# EAGLE design mother_v1 (EAGLE 9.6.2)
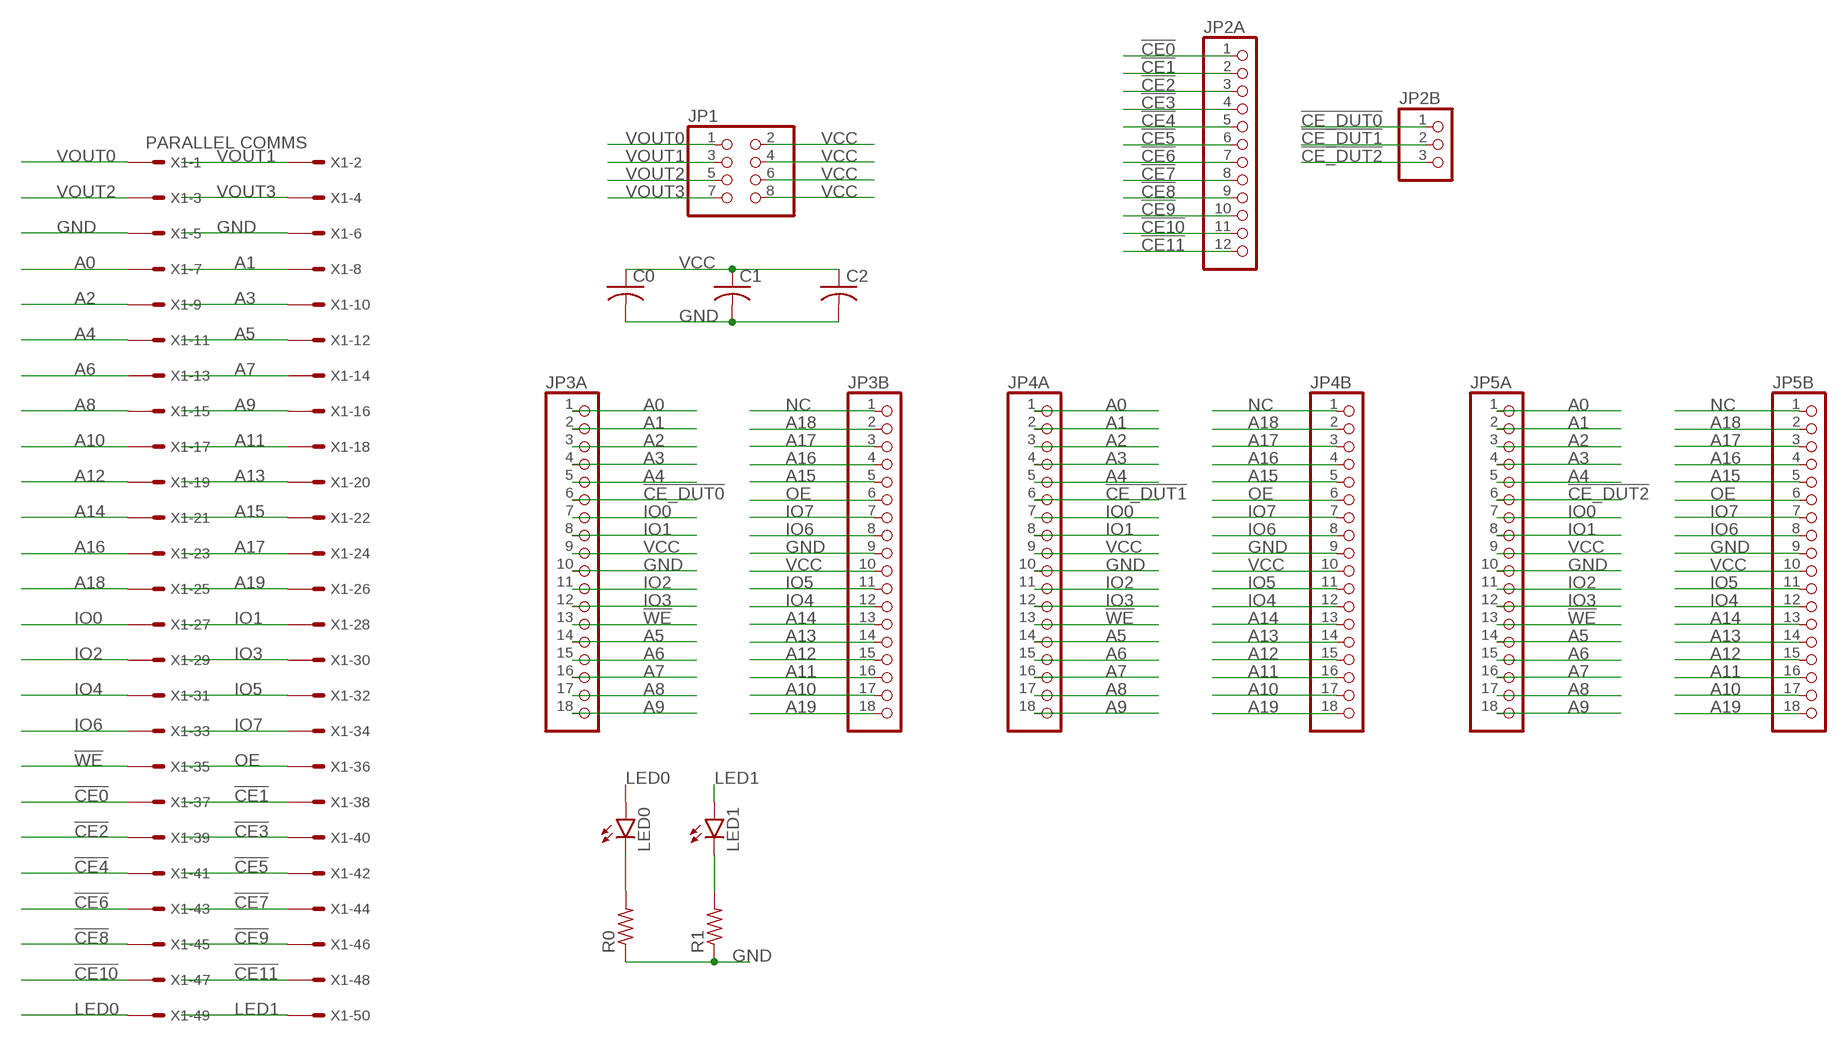
[diagram p0: schematic, sheet 1]

## Parts
C0  C-USC0805  [C0805]
C1  C-USC0805  [C0805]
C2  C-USC0805  [C0805]
JP1  PINHD-2X4  [2X04]
JP2A  PINHD-1X12  [1X12]
JP2B  PINHD-1X3  [1X03]
JP3A  PINHD-1X18  [1X18]
JP3B  PINHD-1X18  [1X18]
JP4A  PINHD-1X18  [1X18]
JP4B  PINHD-1X18  [1X18]
JP5A  PINHD-1X18  [1X18]
JP5B  PINHD-1X18  [1X18]
LED0  LED3MM  [LED3MM]
LED1  LED3MM  [LED3MM]
R0  R-US_0204/7  [0204/7]
R1  R-US_0204/7  [0204/7]
X1  PARALLEL COMMS  057-050-1  [057-050-1]

## Nets
!CE0: JP2A.1 X1.37
!CE1: JP2A.2 X1.38
!CE2: JP2A.3 X1.39
!CE3: JP2A.4 X1.40
!CE4: JP2A.5 X1.41
!CE5: JP2A.6 X1.42
!CE6: JP2A.7 X1.43
!CE7: JP2A.8 X1.44
!CE8: JP2A.9 X1.45
!CE9: JP2A.10 X1.46
!CE10: JP2A.11 X1.47
!CE11: JP2A.12 X1.48
!CE_DUT0: JP2B.1 JP3A.6
!CE_DUT1: JP2B.2 JP4A.6
!CE_DUT2: JP2B.3 JP5A.6
!WE: JP3A.13 JP4A.13 JP5A.13 X1.35
A0: JP3A.1 JP4A.1 JP5A.1 X1.7
A1: JP3A.2 JP4A.2 JP5A.2 X1.8
A2: JP3A.3 JP4A.3 JP5A.3 X1.9
A3: JP3A.4 JP4A.4 JP5A.4 X1.10
A4: JP3A.5 JP4A.5 JP5A.5 X1.11
A5: JP3A.14 JP4A.14 JP5A.14 X1.12
A6: JP3A.15 JP4A.15 JP5A.15 X1.13
A7: JP3A.16 JP4A.16 JP5A.16 X1.14
A8: JP3A.17 JP4A.17 JP5A.17 X1.15
A9: JP3A.18 JP4A.18 JP5A.18 X1.16
A10: JP3B.17 JP4B.17 JP5B.17 X1.17
A11: JP3B.16 JP4B.16 JP5B.16 X1.18
A12: JP3B.15 JP4B.15 JP5B.15 X1.19
A13: JP3B.14 JP4B.14 JP5B.14 X1.20
A14: JP3B.13 JP4B.13 JP5B.13 X1.21
A15: JP3B.5 JP4B.5 JP5B.5 X1.22
A16: JP3B.4 JP4B.4 JP5B.4 X1.23
A17: JP3B.3 JP4B.3 JP5B.3 X1.24
A18: JP3B.2 JP4B.2 JP5B.2 X1.25
A19: JP3B.18 JP4B.18 JP5B.18 X1.26
GND: C0.2 C1.2 C2.2 JP3A.10 JP3B.9 JP4A.10 JP4B.9 JP5A.10 JP5B.9 R0.1 R1.1 X1.5 X1.6
IO0: JP3A.7 JP4A.7 JP5A.7 X1.27
IO1: JP3A.8 JP4A.8 JP5A.8 X1.28
IO2: JP3A.11 JP4A.11 JP5A.11 X1.29
IO3: JP3A.12 JP4A.12 JP5A.12 X1.30
IO4: JP3B.12 JP4B.12 JP5B.12 X1.31
IO5: JP3B.11 JP4B.11 JP5B.11 X1.32
IO6: JP3B.8 JP4B.8 JP5B.8 X1.33
IO7: JP3B.7 JP4B.7 JP5B.7 X1.34
LED0: LED0.A X1.49
LED1: LED1.A X1.50
N$1: LED0.K(C) R0.2
N$2: LED1.K(C) R1.2
NC: JP3B.1 JP4B.1 JP5B.1
OE: JP3B.6 JP4B.6 JP5B.6 X1.36
VCC: C0.1 C1.1 C2.1 JP1.2 JP1.4 JP1.6 JP1.8 JP3A.9 JP3B.10 JP4A.9 JP4B.10 JP5A.9 JP5B.10
VOUT0: JP1.1 X1.1
VOUT1: JP1.3 X1.2
VOUT2: JP1.5 X1.3
VOUT3: JP1.7 X1.4

## Library data of the parts
C0 C1 C2 = rcl:C-US: CAPACITOR, American symbol; SPICEPREFIX: C
JP1 = pinhead:PINHD-2X4: PIN HEADER
JP2A = pinhead:PINHD-1X12: PIN HEADER
JP2B = pinhead:PINHD-1X3: PIN HEADER
JP3A JP3B JP4A JP4B JP5A JP5B = pinhead:PINHD-1X18: PIN HEADER
LED0 LED1 = led:LED: LED OSRAM: - CHIPLED LG R971, LG N971, LY N971, LG Q971, LY Q971, LO R971, LY R971 LH N974, LH R974 LS Q976, LO Q976, LY Q976 LO Q996 - Hyper CHIPLED LW Q18S LB Q993, LB Q99A, LB R99A - SideLED LS A670, LO A670, LY A670, LG A670, LP A670 LB A673, LV A673, LT A673, LW A673 LH A674 LY A675 LS A676, LA A676, LO A676, LY A676, LW A676 LS A679, LY A679, LG A679 - Hyper Micro SIDELED® LS Y876, LA Y876, LO Y876, LY Y876 LT Y87S - SmartLED LW L88C, LW L88S LB L89C, LB L89S, LG L890 LS L89K, LO L89K, LY L89K LS L896, LA L896, LO L896, LY L896 - TOPLED LS T670, LO T670, LY T670, LG T670, LP T670 LSG T670, LSP T670, LSY T670, LOP T670, LYG T670 LG T671, LOG T671, LSG T671 LB T673, LV T673, LT T673, LW T673 LH T674 LS T676, LA T676, LO T676, LY T676, LB T676, LH T676, LSB T676, LW T676 LB T67C, LV T67C, LT T67C, LS T67K, LO T67K, LY T67K, LW E67C LS E67B, LA E67B, LO E67B, LY E67B, LB E67C, LV E67C, LT E67C LW T67C LS T679, LY T679, LG T679 LS T770, LO T770, LY T770, LG T770, LP T770 LB T773, LV T773, LT T773, LW T773 LH T774 LS E675, LA E675, LY E675, LS T675 LS T776, LA T776, LO T776, LY T776, LB T776 LHGB T686 LT T68C, LB T68C - Hyper Mini TOPLED® LB M676 - Mini TOPLED Santana® LG M470 LS M47K, LO M47K, LY M47K Source: http://www.osram.convergy.de LUXEON: - LUMILED® LXK2-PW12-R00, LXK2-PW12-S00, LXK2-PW14-U00, LXK2-PW14-V00 LXK2-PM12-R00, LXK2-PM12-S00, LXK2-PM14-U00 LXK2-PE12-Q00, LXK2-PE12-R00, LXK2-PE12-S00, LXK2-PE14-T00, LXK2-PE14-U00 LXK2-PB12-K00, LXK2-PB12-L00, LXK2-PB12-M00, LXK2-PB14-N00, LXK2-PB14-P00, LXK2-PB14-Q00 LXK2-PR12-L00, LXK2-PR12-M00, LXK2-PR14-Q00, LXK2-PR14-R00 LXK2-PD12-Q00, LXK2-PD12-R00, LXK2-PD12-S00 LXK2-PH12-R00, LXK2-PH12-S00 LXK2-PL12-P00, LXK2-PL12-Q00, LXK2-PL12-R00 Source: www.luxeon.com KINGBRIGHT: KA-3528ASYC Source: www.kingbright.com
R0 R1 = rcl:R-US_: RESISTOR, American symbol; SPICEPREFIX: R
X1 = con-panduit:057-050-: CONNECTOR 50-pin series 057 contact pc board low profile headers; OC_FARNELL: unknown; OC_NEWARK: unknown

## Net classes
2 lowpower: width 0.305 mm, drill 0.483 mm

## Board
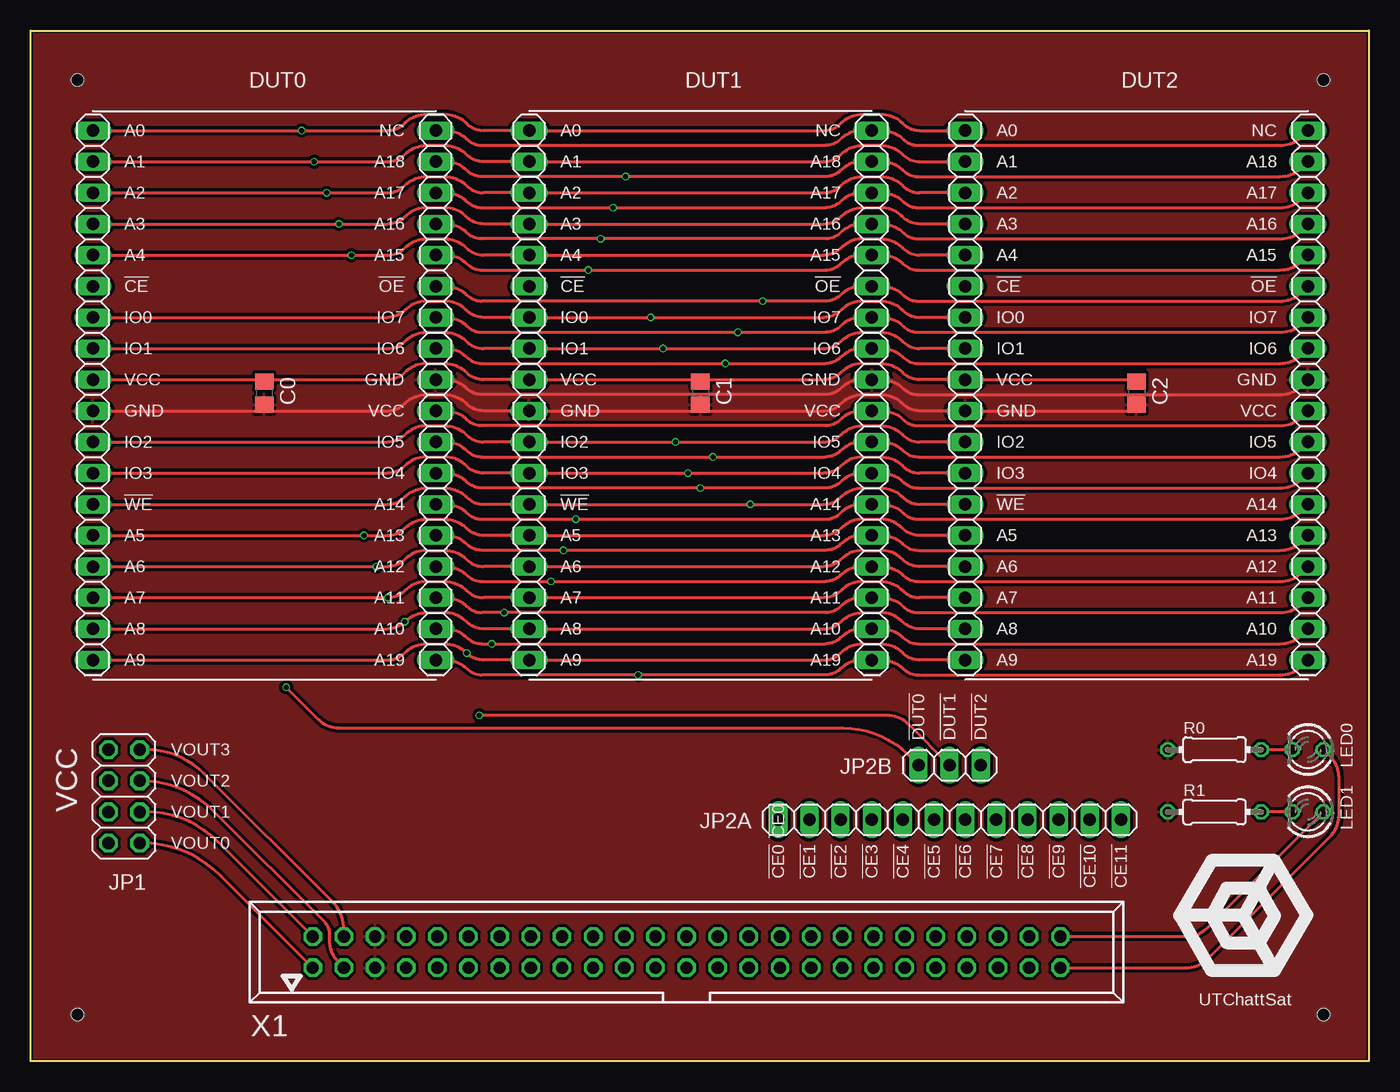
[diagram p1: board, top side]
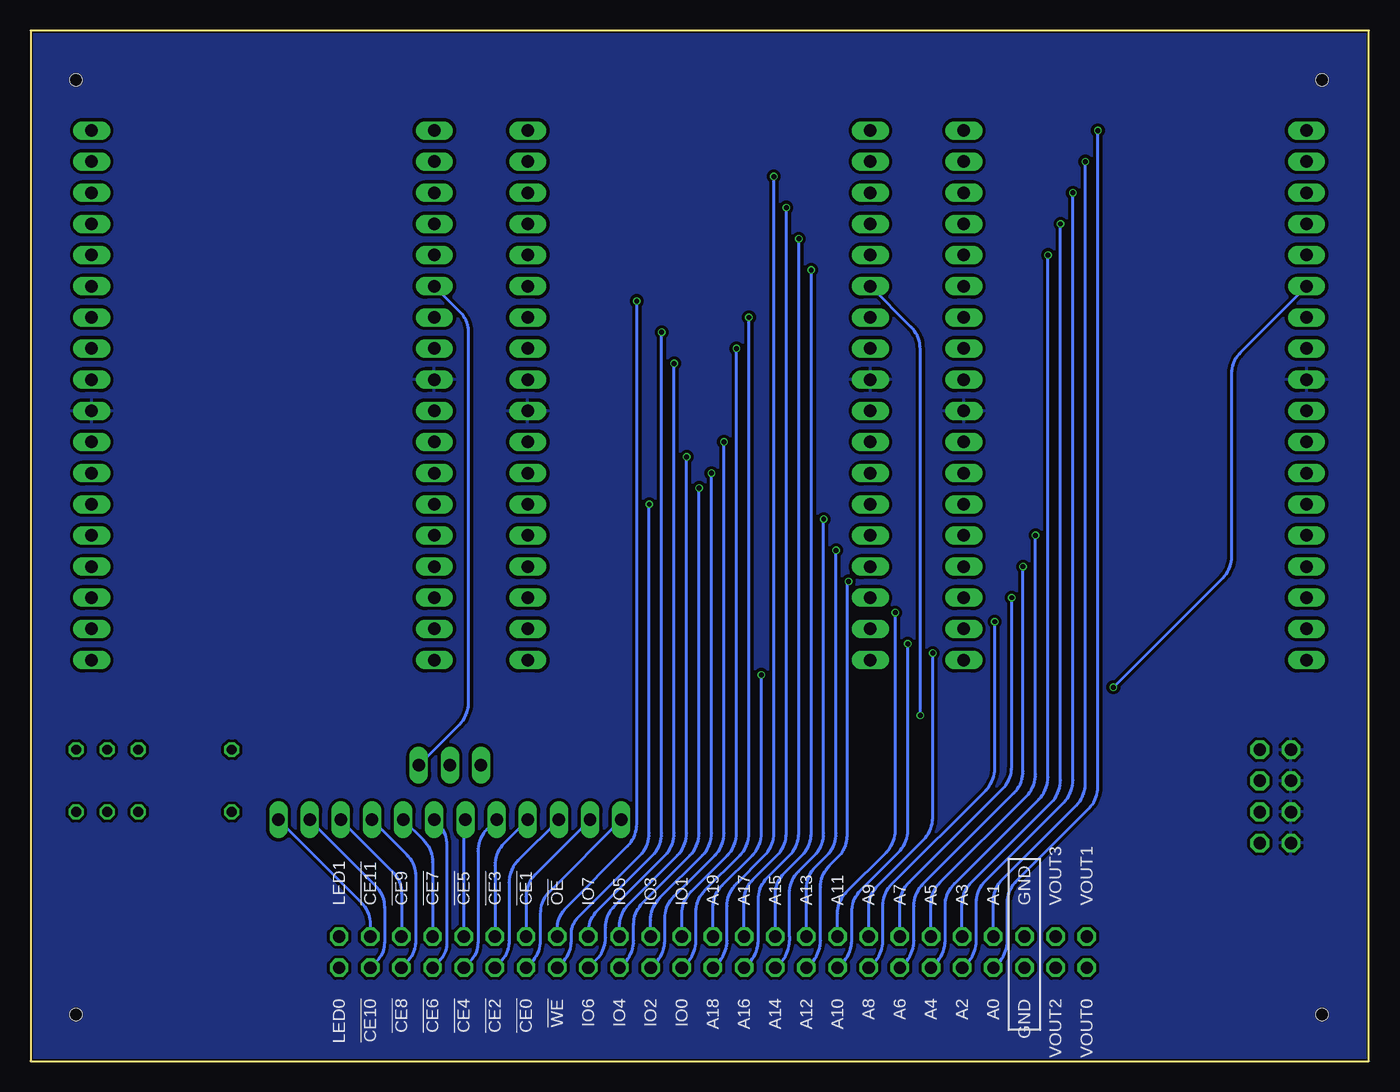
[diagram p2: board, bottom side, seen from below]

Size 109.11 x 84.03 mm. Coordinates in mm from the lower left corner, seen from the top.
Outline: 0,0 0,84.03 109.11,84.03 109.11,0 0,0
Copper layers (1*16): Top 0.035mm / dielectric 0.2mm / Bottom 0.035mm
Design rules "jlcpcb-2-layer *": minimum track width 10mil, minimum drill 0.2mm, track to track 10mil, track to pad 10mil, pad to pad 5mil, via to via 5mil, smd to smd 0mil, copper to edge 0.1mm, drill to drill 5mil, minimum pad ring 4mil, minimum via ring 4mil, stop-mask expansion 3mil, vias tented up to drill 100mil, thermal gap 10mil
Holes 1 mm at 3.81,3.81 3.81,80.01 105.41,80.01 105.41,3.81

### Footprints (pad centres in the part's own frame; a part is rotated, then mirrored left to right if it is on the bottom)
C0805 = smd 1.3 x 1.5: 1 -0.95,0; 2 0.95,0
2X04 = drill 1.016 octagon: 1 -3.81,-1.27; 2 -3.81,1.27; 3 -1.27,-1.27; 4 -1.27,1.27; 5 1.27,-1.27; 6 1.27,1.27; 7 3.81,-1.27; 8 3.81,1.27
1X12 = drill 1.016 long: 1 -13.97,0; 2 -11.43,0; 3 -8.89,0; 4 -6.35,0; 5 -3.81,0; 6 -1.27,0; 7 1.27,0; 8 3.81,0; 9 6.35,0; 10 8.89,0; 11 11.43,0; 12 13.97,0
1X03 = drill 1.016 long: 1 -2.54,0; 2 0,0; 3 2.54,0
1X18 = drill 1.016 long: 1 -21.59,0; 2 -19.05,0; 3 -16.51,0; 4 -13.97,0; 5 -11.43,0; 6 -8.89,0; 7 -6.35,0; 8 -3.81,0; 9 -1.27,0; 10 1.27,0; 11 3.81,0; 12 6.35,0; 13 8.89,0; 14 11.43,0; 15 13.97,0; 16 16.51,0; 17 19.05,0; 18 21.59,0
LED3MM = drill 0.813 octagon: A -1.27,0; K 1.27,0
0204/7 = drill 0.813 octagon: 1 -3.81,0; 2 3.81,0
057-050-1 = drill 1 octagon: 1 -30.48,-1.27; 2 -30.48,1.27; 3 -27.94,-1.27; 4 -27.94,1.27; 5 -25.4,-1.27; 6 -25.4,1.27; 7 -22.86,-1.27; 8 -22.86,1.27; 9 -20.32,-1.27; 10 -20.32,1.27; 11 -17.78,-1.27; 12 -17.78,1.27; 13 -15.24,-1.27; 14 -15.24,1.27; 15 -12.7,-1.27; 16 -12.7,1.27; 17 -10.16,-1.27; 18 -10.16,1.27; 19 -7.62,-1.27; 20 -7.62,1.27; 21 -5.08,-1.27; 22 -5.08,1.27; 23 -2.54,-1.27; 24 -2.54,1.27; 25 0,-1.27; 26 0,1.27; 27 2.54,-1.27; 28 2.54,1.27; 29 5.08,-1.27; 30 5.08,1.27; 31 7.62,-1.27; 32 7.62,1.27; 33 10.16,-1.27; 34 10.16,1.27; 35 12.7,-1.27; 36 12.7,1.27; 37 15.24,-1.27; 38 15.24,1.27; 39 17.78,-1.27; 40 17.78,1.27; 41 20.32,-1.27; 42 20.32,1.27; 43 22.86,-1.27; 44 22.86,1.27; 45 25.4,-1.27; 46 25.4,1.27; 47 27.94,-1.27; 48 27.94,1.27; 49 30.48,-1.27; 50 30.48,1.27

### Placement (x,y rotation side)
C0  19.05,54.48 270 top
C1  54.61,54.48 270 top
C2  90.17,54.48 270 top
JP1  7.62,21.59 90 top
JP2A  74.93,19.68 0 top
JP2B  74.93,24.13 0 top
JP3A  5.08,54.3 270 top
JP3B  33.02,54.3 270 top
JP4A  40.64,54.3 270 top
JP4B  68.58,54.3 270 top
JP5A  76.2,54.3 270 top
JP5B  104.14,54.3 270 top
LED0  104.14,25.4 180 top
LED1  104.14,20.32 180 top
R0  96.52,25.4 0 top
R1  96.52,20.32 0 top
X1  53.48,8.89 0 top

### Tracks (layer width: path | path; a pad name or v marks a point on that pad's centre or on a via)
!CE0
  Bottom 0.254: JP2A.1 66.82,13.82 arc-45 67.56,12.03 67.56,9.83 arc45 68.31,8.03 X1.37
!CE1
  Bottom 0.254: JP2A.2 67.98,15.21 arc-45 68.72,13.41 X1.38
!CE2
  Bottom 0.254: JP2A.3 69.36,16.36 arc-45 70.1,14.57 70.1,9.83 arc45 70.85,8.03 X1.39
!CE3
  Bottom 0.254: JP2A.4 70.52,17.75 arc-45 71.26,15.95 X1.40
!CE4
  Bottom 0.254: JP2A.5 71.9,18.91 arc-45 72.64,17.11 72.64,9.65 arc45 73.26,8.16 X1.41
!CE5
  Bottom 0.254: JP2A.6 arc-45 73.8,19.35 X1.42
!CE6
  Bottom 0.254: JP2A.7 75.93,19.41 arc45 75.18,17.62 75.18,9.65 arc45 75.8,8.16 X1.43
!CE7
  Bottom 0.254: JP2A.8 77.08,18.03 arc45 76.34,16.23 X1.44
!CE8
  Bottom 0.254: JP2A.9 78.47,16.87 arc45 77.72,15.08 77.72,9.83 arc45 78.47,8.03 X1.45
!CE9
  Bottom 0.254: JP2A.10 79.62,15.49 arc45 78.88,13.69 X1.46
!CE10
  Bottom 0.254: JP2A.11 81.01,14.33 arc45 80.26,12.54 80.26,9.65 arc45 80.88,8.16 X1.47
!CE11
  Bottom 0.254: JP2A.12 82.16,12.95 arc45 81.42,11.15 X1.48
!CE_DUT0  (via drill 0.4)
  Top 0.254: JP2B.1 71.55,24.97 arc45 66.21,27.18 25.18,27.18 arc-45 23.39,27.92 v20.83,30.48
  Bottom 0.254: v20.83,30.48 11.92,39.39 arc-45 11.18,41.18 11.18,56.04 arc45 10.43,57.84 JP3A.6
!CE_DUT1  (via drill 0.4)
  Top 0.254: JP2B.2 71.61,27.45 arc45 69.81,28.19 v36.58,28.19
  Bottom 0.254: v36.58,28.19 36.58,58.07 arc-45 37.32,59.87 JP4A.6
!CE_DUT2
  Bottom 0.254: JP2B.3 74.15,27.45 arc-45 73.41,29.25 73.41,59.44 arc-45 74.08,61.08 JP5A.6
!WE  (via drill 0.4)
  Top 0.254: JP3A.13 29.12,45.41 arc45 30.48,45.97 30.5,45.99 arc-45 32.29,46.74 33.75,46.74 arc-45 35.54,45.99 35.56,45.97 arc45 36.92,45.41 JP4A.13 v58.67,45.41 64.68,45.41 arc45 66.04,45.97 66.06,45.99 arc-45 67.85,46.74 69.31,46.74 arc-45 71.1,45.99 71.12,45.97 arc45 72.48,45.41 JP5A.13
  Bottom 0.254: X1.35 65.77,8.03 arc-45 65.02,9.83 65.02,10.41 arc45 64.48,11.71 59.42,16.78 arc-45 58.67,18.58 v58.67,45.41
A0  (via drill 0.4)
  Top 0.254: JP3A.1 v22.1,75.89 29.12,75.89 arc45 30.48,76.45 30.5,76.47 arc-45 32.29,77.22 33.75,77.22 arc-45 35.54,76.47 35.56,76.45 arc45 36.92,75.89 JP4A.1 64.68,75.89 arc45 66.04,76.45 66.04,76.47 66.06,76.47 arc-45 67.85,77.22 69.31,77.22 arc-45 71.1,76.47 71.12,76.47 71.12,76.45 arc45 72.48,75.89 JP5A.1
  Bottom 0.254: X1.7 30.21,8.03 arc-45 29.46,9.83 29.46,12.92 arc45 28.72,14.71 22.84,20.59 arc-45 22.1,22.39 v22.1,75.89
A1  (via drill 0.4)
  Top 0.254: JP3A.2 v23.11,73.35 29.12,73.35 arc45 30.48,73.91 30.5,73.93 arc-45 32.29,74.68 33.75,74.68 arc-45 35.54,73.93 35.56,73.91 arc45 36.92,73.35 JP4A.2 64.68,73.35 arc45 66.04,73.91 66.06,73.93 arc-45 67.85,74.68 69.31,74.68 arc-45 71.1,73.93 71.12,73.91 arc45 72.48,73.35 JP5A.2
  Bottom 0.254: X1.8 30.62,13.03 arc45 29.88,14.83 23.86,20.85 arc-45 23.11,22.64 v23.11,73.35
A2  (via drill 0.4)
  Top 0.254: JP3A.3 v24.13,70.81 29.12,70.81 arc45 30.48,71.37 30.5,71.39 arc-45 32.29,72.14 33.75,72.14 arc-45 35.54,71.39 35.56,71.37 arc45 36.92,70.81 JP4A.3 64.68,70.81 arc45 66.04,71.37 66.04,71.39 66.06,71.39 arc-45 67.85,72.14 69.31,72.14 arc-45 71.1,71.39 71.12,71.39 71.12,71.37 arc45 72.48,70.81 JP5A.3
  Bottom 0.254: X1.9 32.75,8.03 arc-45 32,9.83 32,12.92 arc45 31.26,14.71 24.87,21.1 arc-45 24.13,22.9 v24.13,70.81
A3  (via drill 0.4)
  Top 0.254: JP3A.4 v25.15,68.27 29.12,68.27 arc45 30.48,68.83 30.5,68.85 arc-45 32.29,69.6 33.75,69.6 arc-45 35.54,68.85 35.56,68.83 arc45 36.92,68.27 JP4A.4 64.68,68.27 arc45 66.04,68.83 66.04,68.85 66.06,68.85 arc-45 67.85,69.6 69.31,69.6 arc-45 71.1,68.85 71.1,68.83 71.12,68.83 arc45 72.48,68.27 JP5A.4
  Bottom 0.254: X1.10 33.16,12.78 arc45 32.42,14.57 25.89,21.1 arc-45 25.15,22.9 v25.15,68.27
A4  (via drill 0.4)
  Top 0.254: JP3A.5 v26.16,65.73 29.12,65.73 arc45 30.48,66.29 30.5,66.31 arc-45 32.29,67.06 33.75,67.06 arc-45 35.54,66.31 35.56,66.29 arc45 36.92,65.73 JP4A.5 64.68,65.73 arc45 66.04,66.29 66.06,66.29 66.06,66.31 arc-45 67.85,67.06 69.31,67.06 arc-45 71.1,66.31 71.12,66.31 71.12,66.29 arc45 72.48,65.73 JP5A.5
  Bottom 0.254: X1.11 35.29,8.03 arc-45 34.54,9.83 34.54,12.66 arc45 33.8,14.46 26.91,21.35 arc-45 26.16,23.15 v26.16,65.73
A5  (via drill 0.4)
  Top 0.254: JP3A.14 v27.18,42.87 29.12,42.87 arc45 30.48,43.43 30.5,43.45 arc-45 32.29,44.2 33.75,44.2 arc-45 35.54,43.45 35.56,43.43 arc45 36.92,42.87 JP4A.14 64.68,42.87 arc45 66.04,43.43 66.06,43.45 arc-45 67.85,44.2 69.31,44.2 arc-45 71.1,43.45 71.12,43.43 arc45 72.48,42.87 JP5A.14
  Bottom 0.254: X1.12 35.7,12.78 arc45 34.96,14.57 27.92,21.61 arc-45 27.18,23.4 v27.18,42.87
A6  (via drill 0.4)
  Top 0.254: JP3A.15 v28.19,40.33 29.12,40.33 arc45 30.48,40.89 30.5,40.91 arc-45 32.29,41.66 33.75,41.66 arc-45 35.54,40.91 35.56,40.89 arc45 36.92,40.33 JP4A.15 64.68,40.33 arc45 66.04,40.89 66.06,40.91 arc-45 67.85,41.66 69.31,41.66 arc-45 71.1,40.91 71.12,40.89 arc45 72.48,40.33 JP5A.15
  Bottom 0.254: X1.13 37.83,8.03 arc-45 37.08,9.83 37.08,12.66 arc45 36.34,14.46 28.94,21.86 arc-45 28.19,23.66 v28.19,40.33
A7  (via drill 0.4)
  Top 0.254: JP3A.16 v29.12,37.79 arc45 30.48,38.35 30.5,38.37 arc-45 32.29,39.12 33.75,39.12 arc-45 35.54,38.37 35.56,38.35 arc45 36.92,37.79 JP4A.16 64.68,37.79 arc45 66.04,38.35 66.06,38.37 arc-45 67.85,39.12 69.31,39.12 arc-45 71.1,38.37 71.12,38.35 arc45 72.48,37.79 JP5A.16
  Bottom 0.254: X1.14 38.24,12.78 arc45 37.5,14.57 29.86,22.21 arc-45 29.12,24 v29.12,37.79
A8  (via drill 0.4)
  Top 0.254: JP3A.17 29.12,35.25 arc45 30.48,35.81 v30.5,35.83 arc-45 32.29,36.58 33.75,36.58 arc-45 35.54,35.83 35.56,35.81 arc45 36.92,35.25 JP4A.17 64.68,35.25 arc45 66.04,35.81 66.06,35.83 arc-45 67.85,36.58 69.31,36.58 arc-45 71.1,35.83 71.12,35.81 arc45 72.48,35.25 JP5A.17
  Bottom 0.254: X1.15 40.37,8.03 arc-45 39.62,9.83 39.62,12.66 arc45 38.88,14.46 31.24,22.1 arc-45 30.5,23.89 v30.5,35.83
A9  (via drill 0.4)
  Top 0.254: JP3A.18 29.12,32.71 arc45 30.48,33.27 30.5,33.29 arc-45 32.29,34.04 33.75,34.04 arc-45 35.54,33.29 v35.56,33.27 arc45 36.92,32.71 JP4A.18 64.68,32.71 arc45 66.04,33.27 66.06,33.29 arc-45 67.85,34.04 69.31,34.04 arc-45 71.1,33.29 71.12,33.27 arc45 72.48,32.71 JP5A.18
  Bottom 0.254: X1.16 40.78,12.52 arc45 40.04,14.32 36.3,18.05 arc-45 35.56,19.85 v35.56,33.27
A10  (via drill 0.4)
  Top 0.254: 32.18,35.25 JP3B.17 33.86,35.25 arc-45 35.56,34.54 arc45 36.79,34.04 v37.59,34.04 64.81,34.04 arc45 66.04,34.54 arc-45 67.74,35.25 JP4B.17 69.42,35.25 arc-45 71.12,34.54 arc45 72.35,34.04 101.87,34.04 arc45 103.67,34.78 JP5B.17
  Bottom 0.254: X1.17 42.91,8.03 arc-45 42.16,9.83 42.16,12.16 arc45 41.42,13.95 38.34,17.04 arc-45 37.59,18.83 v37.59,34.04
A11  (via drill 0.4)
  Top 0.254: 32.18,37.79 JP3B.16 33.86,37.79 arc-45 35.56,37.08 arc45 36.79,36.58 v38.61,36.58 64.81,36.58 arc45 66.04,37.08 arc-45 67.74,37.79 JP4B.16 69.42,37.79 arc-45 71.12,37.08 arc45 72.35,36.58 101.87,36.58 arc45 103.67,37.32 JP5B.16
  Bottom 0.254: X1.18 43.32,12.02 arc45 42.58,13.81 39.35,17.04 arc-45 38.61,18.83 v38.61,36.58
A12  (via drill 0.4)
  Top 0.254: 32.18,40.33 JP3B.15 33.86,40.33 arc-45 35.56,39.62 arc45 36.79,39.12 v42.42,39.12 64.81,39.12 arc45 66.04,39.62 arc-45 67.74,40.33 JP4B.15 69.42,40.33 arc-45 71.12,39.62 arc45 72.35,39.12 101.87,39.12 arc45 103.67,39.86 JP5B.15
  Bottom 0.254: X1.19 45.45,8.03 arc-45 44.7,9.83 44.7,14.19 arc45 43.96,15.98 43.16,16.78 arc-45 42.55,18.27 42.55,38.99 v42.42,39.12
A13  (via drill 0.4)
  Top 0.254: 32.18,42.87 JP3B.14 33.86,42.87 arc-45 35.56,42.16 arc45 36.79,41.66 v43.43,41.66 64.81,41.66 arc45 66.04,42.16 arc-45 67.74,42.87 JP4B.14 69.42,42.87 arc-45 71.12,42.16 arc45 72.35,41.66 101.87,41.66 arc45 103.67,42.4 JP5B.14
  Bottom 0.254: X1.20 45.86,14.05 arc45 45.12,15.84 44.18,16.78 arc-45 43.43,18.58 v43.43,41.66
A14  (via drill 0.4)
  Top 0.254: 32.18,45.41 JP3B.13 33.86,45.41 arc-45 35.56,44.7 arc45 36.79,44.2 v44.45,44.2 64.81,44.2 arc45 66.04,44.7 arc-45 67.74,45.41 JP4B.13 69.42,45.41 arc-45 71.12,44.7 arc45 72.35,44.2 101.87,44.2 arc45 103.67,44.94 JP5B.13
  Bottom 0.254: X1.21 47.99,8.03 arc-45 47.24,9.83 47.24,10.16 47.24,13.68 arc45 46.5,15.48 45.19,16.78 arc-45 44.45,18.58 v44.45,44.2
A15  (via drill 0.4)
  Top 0.254: 32.18,65.73 JP3B.5 33.86,65.73 arc-45 35.56,65.02 arc45 36.79,64.52 v45.47,64.52 64.81,64.52 arc45 66.04,65.02 arc-45 67.74,65.73 JP4B.5 69.42,65.73 arc-45 71.12,65.02 arc45 72.35,64.52 101.87,64.52 arc45 103.67,65.26 JP5B.5
  Bottom 0.254: X1.22 48.4,13.54 arc45 47.66,15.34 46.21,16.78 arc-45 45.47,18.58 v45.47,64.52
A16  (via drill 0.4)
  Top 0.254: 32.18,68.27 JP3B.4 33.86,68.27 arc-45 35.56,67.56 arc45 36.79,67.06 v46.48,67.06 64.81,67.06 arc45 66.04,67.56 arc-45 67.74,68.27 JP4B.4 69.42,68.27 arc-45 71.12,67.56 arc45 72.35,67.06 101.87,67.06 arc45 103.67,67.8 JP5B.4
  Bottom 0.254: X1.23 50.53,8.03 arc-45 49.78,9.83 49.78,13.17 arc45 49.04,14.97 47.23,16.78 arc-45 46.48,18.58 v46.48,67.06
A17  (via drill 0.4)
  Top 0.254: 32.18,70.81 JP3B.3 33.86,70.81 arc-45 35.56,70.1 arc45 36.79,69.6 v47.5,69.6 64.81,69.6 arc45 66.04,70.1 arc-45 67.74,70.81 JP4B.3 69.42,70.81 arc-45 71.12,70.1 arc45 72.35,69.6 101.87,69.6 arc45 103.67,70.34 JP5B.3
  Bottom 0.254: X1.24 50.94,13.03 arc45 50.2,14.83 48.24,16.78 arc-45 47.5,18.58 v47.5,69.6
A18  (via drill 0.4)
  Top 0.254: 32.18,73.35 JP3B.2 33.86,73.35 arc-45 35.56,72.64 arc45 36.79,72.14 v48.51,72.14 64.81,72.14 arc45 66.04,72.64 arc-45 67.74,73.35 JP4B.2 69.42,73.35 arc-45 71.12,72.64 arc45 72.35,72.14 101.87,72.14 arc45 103.67,72.88 JP5B.2
  Bottom 0.254: X1.25 53.07,8.03 arc-45 52.32,9.83 52.32,12.66 arc45 51.58,14.46 49.26,16.78 arc-45 48.51,18.58 v48.51,72.14
A19  (via drill 0.4)
  Top 0.254: 32.18,32.71 JP3B.18 33.86,32.71 arc-45 35.56,32 arc45 36.79,31.5 v49.53,31.5 64.81,31.5 arc45 66.04,32 arc-45 67.74,32.71 JP4B.18 69.42,32.71 arc-45 71.12,32 arc45 72.35,31.5 101.87,31.5 arc45 103.67,32.24 JP5B.18
  Bottom 0.254: X1.26 53.48,12.52 arc45 52.74,14.32 50.27,16.78 arc-45 49.53,18.58 v49.53,31.5
GND
  Top 0.254: 32.18,55.57 JP3B.9 33.86,55.57 arc-45 35.56,54.86 arc45 36.79,54.36 64.81,54.36 arc45 66.04,54.86 arc-45 67.74,55.57 JP4B.9 69.42,55.57 arc-45 71.12,54.86 arc45 72.35,54.36 101.87,54.36 arc45 103.67,55.1 JP5B.9 | JP3A.10 19.05,53.03 | 19.05,53.03 29.12,53.03 arc45 30.48,53.59 30.5,53.61 arc-45 32.29,54.36 33.75,54.36 arc-45 35.54,53.61 35.56,53.59 arc45 36.92,53.03 JP4A.10 54.61,53.03 | 54.61,53.03 64.68,53.03 arc45 66.04,53.59 66.06,53.61 arc-45 67.85,54.36 69.31,54.36 arc-45 71.1,53.61 71.12,53.59 arc45 72.48,53.03 JP5A.10 89.67,53.03 arc45 C2.2 | C1.2 54.61,53.03 | C0.2 19.05,53.03
  pour Top: 0,83.82 109.22,83.82 109.22,0 0,0
IO0  (via drill 0.4)
  Top 0.254: JP3A.7 29.12,60.65 arc45 30.48,61.21 30.5,61.23 arc-45 32.29,61.98 33.75,61.98 arc-45 35.54,61.23 35.56,61.21 arc45 36.92,60.65 JP4A.7 v50.55,60.65 64.68,60.65 arc45 66.04,61.21 66.06,61.21 66.06,61.23 arc-45 67.85,61.98 69.31,61.98 arc-45 71.1,61.23 71.12,61.23 71.12,61.21 arc45 72.48,60.65 JP5A.7
  Bottom 0.254: X1.27 55.61,8.03 arc-45 54.86,9.83 54.86,12.16 arc45 54.12,13.95 51.29,16.78 arc-45 50.55,18.58 v50.55,60.65
IO1  (via drill 0.4)
  Top 0.254: JP3A.8 29.12,58.11 arc45 30.48,58.67 30.5,58.69 arc-45 32.29,59.44 33.75,59.44 arc-45 35.54,58.69 35.56,58.67 arc45 36.92,58.11 JP4A.8 v51.56,58.11 64.68,58.11 arc45 66.04,58.67 66.04,58.69 66.06,58.69 arc-45 67.85,59.44 69.31,59.44 arc-45 71.1,58.69 71.12,58.69 71.12,58.67 arc45 72.48,58.11 JP5A.8
  Bottom 0.254: X1.28 56.02,12.02 arc45 55.28,13.81 52.31,16.78 arc-45 51.56,18.58 v51.56,58.11
IO2  (via drill 0.4)
  Top 0.254: JP3A.11 29.12,50.49 arc45 30.48,51.05 30.5,51.07 arc-45 32.29,51.82 33.75,51.82 arc-45 35.54,51.07 35.56,51.05 arc45 36.92,50.49 JP4A.11 v52.58,50.49 64.68,50.49 arc45 66.04,51.05 66.04,51.07 66.06,51.07 arc-45 67.85,51.82 69.31,51.82 arc-45 71.1,51.07 71.12,51.07 71.12,51.05 arc45 72.48,50.49 JP5A.11
  Bottom 0.254: X1.29 58.15,8.03 arc-45 57.4,9.83 57.4,11.65 arc45 56.66,13.44 53.32,16.78 arc-45 52.58,18.58 v52.58,50.49
IO3  (via drill 0.4)
  Top 0.254: 66.04,48.51 arc-45 64.68,47.95 v53.59,47.95 JP4A.12 36.92,47.95 arc-45 35.56,48.51 35.54,48.53 arc45 33.75,49.28 32.29,49.28 arc45 30.5,48.53 30.48,48.51 arc-45 29.12,47.95 JP3A.12 | 66.06,48.53 arc-45 67.85,49.28 69.31,49.28 arc-45 71.1,48.53 | 71.12,48.51 arc45 72.48,47.95 JP5A.12
  Bottom 0.254: X1.30 58.56,11.51 arc45 57.82,13.3 54.34,16.78 arc-45 53.59,18.58 v53.59,47.95
IO4  (via drill 0.4)
  Top 0.254: 32.18,47.95 JP3B.12 33.86,47.95 arc-45 35.56,47.24 arc45 36.79,46.74 v54.61,46.74 64.81,46.74 arc45 66.04,47.24 arc-45 67.74,47.95 JP4B.12 69.42,47.95 arc-45 71.12,47.24 arc45 72.35,46.74 101.87,46.74 arc45 103.67,47.48 JP5B.12
  Bottom 0.254: X1.31 60.69,8.03 arc-45 59.94,9.83 59.94,11.14 arc45 59.2,12.94 55.35,16.78 arc-45 54.61,18.58 v54.61,46.74
IO5  (via drill 0.4)
  Top 0.254: 32.18,50.49 JP3B.11 33.86,50.49 arc-45 35.56,49.78 arc45 36.79,49.28 v55.63,49.28 64.81,49.28 arc45 66.04,49.78 arc-45 67.74,50.49 JP4B.11 69.42,50.49 arc-45 71.12,49.78 arc45 72.35,49.28 101.87,49.28 arc45 103.67,50.02 JP5B.11
  Bottom 0.254: X1.32 61.1,11 arc45 60.36,12.8 56.37,16.78 arc-45 55.63,18.58 v55.63,49.28
IO6  (via drill 0.4)
  Top 0.254: 32.18,58.11 JP3B.8 33.86,58.11 arc-45 35.56,57.4 arc45 36.79,56.9 v56.64,56.9 64.81,56.9 arc45 66.04,57.4 arc-45 67.74,58.11 JP4B.8 69.42,58.11 arc-45 71.12,57.4 arc45 72.35,56.9 101.87,56.9 arc45 103.67,57.64 JP5B.8
  Bottom 0.254: X1.33 62.97,8.29 arc-45 62.23,10.08 62.23,10.89 arc45 61.49,12.68 57.39,16.78 arc-45 56.64,18.58 v56.64,56.9
IO7  (via drill 0.4)
  Top 0.254: 32.18,60.65 JP3B.7 33.86,60.65 arc-45 35.56,59.94 arc45 36.79,59.44 v57.66,59.44 64.81,59.44 arc45 66.04,59.94 arc-45 67.74,60.65 JP4B.7 69.42,60.65 arc-45 71.12,59.94 arc45 72.35,59.44 101.87,59.44 arc45 103.67,60.18 JP5B.7
  Bottom 0.254: X1.34 63.64,10.49 arc45 62.9,12.29 58.4,16.78 arc-45 57.66,18.58 v57.66,59.44
LED0
  Top 0.254: X1.49 94.2,7.62 arc45 95.99,8.36 105.94,18.31 arc45 106.68,20.1 106.68,23.08 arc45 105.94,24.87 LED0.A
LED1
  Top 0.254: X1.50 94.2,10.16 arc45 95.99,10.9 LED1.A
N$1
  Top 0.254: LED0.K R0.2
N$2
  Top 0.254: LED1.K R1.2
NC
  Top 0.254: 32.18,75.89 JP3B.1 33.86,75.89 arc-45 35.56,75.18 arc45 36.79,74.68 64.81,74.68 arc45 66.04,75.18 arc-45 67.74,75.89 JP4B.1 69.42,75.89 arc-45 71.12,75.18 arc45 72.35,74.68 72.39,74.68 101.87,74.68 arc45 103.67,75.42 JP5B.1
OE  (via drill 0.4)
  Top 0.254: 32.18,63.19 JP3B.6 33.86,63.19 arc-45 35.56,62.48 arc45 36.79,61.98 v59.69,61.98 64.81,61.98 arc45 66.04,62.48 arc-45 67.74,63.19 JP4B.6 69.42,63.19 arc-45 71.12,62.48 arc45 72.35,61.98 101.87,61.98 arc45 103.67,62.72 JP5B.6
  Bottom 0.254: X1.36 66.18,10.75 arc45 65.44,12.54 60.43,17.54 arc-45 59.69,19.34 v59.69,61.98
VCC
  Top 0.254: 32.18,53.03 JP3B.10 33.86,53.03 arc-45 35.56,52.32 arc45 36.79,51.82 64.81,51.82 arc45 66.04,52.32 arc-45 67.74,53.03 JP4B.10 69.42,53.03 arc-45 71.12,52.32 arc45 72.35,51.82 101.87,51.82 arc45 103.67,52.56 JP5B.10 | 35.54,56.15 arc45 33.75,56.9 32.29,56.9 arc45 30.5,56.15 30.48,56.13 arc-45 29.12,55.57 19.05,55.57 | 35.56,56.13 arc45 36.92,55.57 JP4A.9 54.61,55.57 | 71.1,56.15 arc45 69.31,56.9 67.85,56.9 arc45 66.06,56.15 66.06,56.13 66.04,56.13 arc-45 64.68,55.57 54.61,55.57 | 71.12,56.13 arc45 72.48,55.57 JP5A.9 89.84,55.57 arc-45 C2.1 | JP3A.9 19.05,55.57 | C1.1 54.61,55.57 | C0.1 19.05,55.57
  pour Bottom: 0,0 0,83.82 109.22,83.82 109.22,0
VOUT0
  Top 0.254: X1.1 15.5,15.12 arc45 9.08,17.78 JP1.1
VOUT1
  Top 0.254: X1.2 15.24,17.92 arc45 9.44,20.32 JP1.3
VOUT2
  Top 0.254: X1.3 25.13,8.03 arc-45 24.38,9.83 24.38,10.38 arc45 24,11.31 14.92,20.38 arc45 8.94,22.86 JP1.5
VOUT3
  Top 0.254: X1.4 25.54,10.75 arc45 24.62,12.98 14.16,23.43 arc45 9.4,25.4 JP1.7

### Text on the board
tPlace: DUT0 | DUT1 | DUT2 | A0 | NC | A0 | NC | A0 | NC | A1 | A18 | A1 | A18 | A1 | A18 | A2 | A17 | A2 | A17 | A2 | A17 | A3 | A16 | A3 | A16 | A3 | A16 | A4 | A15 | A4 | A15 | A4 | A15 | !CE | !OE | !CE | !OE | !CE | !OE | IO0 | IO7 | IO0 | IO7 | IO0 | IO7 | IO1 | IO6 | IO1 | IO6 | IO1 | IO6 | VCC | GND | VCC | GND | VCC | GND | GND | VCC | GND | VCC | GND | VCC | IO2 | IO5 | IO2 | IO5 | IO2 | IO5 | IO3 | IO4 | IO3 | IO4 | IO3 | IO4 | !WE | A14 | !WE | A14 | !WE | A14 | A5 | A13 | A5 | A13 | A5 | A13 | A6 | A12 | A6 | A12 | A6 | A12 | A7 | A11 | A7 | A11 | A7 | A11 | A8 | A10 | A8 | A10 | A8 | A10 | A9 | A19 | A9 | A19 | A9 | A19 | !DUT0 | !DUT1 | !DUT2 | VOUT3 | VOUT2 | !CE0 | VCC | VOUT1 | VOUT0 | !CE0 | !CE1 | !CE2 | !CE3 | !CE4 | !CE5 | !CE6 | !CE7 | !CE8 | !CE9 | !CE10 | !CE11 | JP1
bPlace: VOUT1 | VOUT3 | GND | A1 | A3 | A5 | A7 | A9 | A11 | A13 | A15 | A17 | A19 | IO1 | IO3 | IO5 | IO7 | !OE | !CE1 | !CE3 | !CE5 | !CE7 | !CE9 | !CE11 | LED1 | VOUT0 | VOUT2 | GND | A0 | A2 | A4 | A6 | A8 | A10 | A12 | A14 | A16 | A18 | IO0 | IO2 | IO4 | IO6 | !WE | !CE0 | !CE2 | !CE4 | !CE6 | !CE8 | !CE10 | LED0
tNames: UTChattSat